# Altium schematic sheet Isolators.SchDoc: Optocouplers
size A3; Author: M.Beldyga; CompanyName: WUT ISE; DrawnBy: M.Beldyga; Organization: WUT ISE; Address1: PW ISE; Address2: Nowowiejska 15/19 00-665 Warsaw; Address3: micbeldyga@gmail.com; SheetNumber: 6; SheetTotal: 7; ModifiedBy: -; CheckedDate: -; DivGrp: WUT ISE; Designer: M.Beldyga; ModifiedDate: -; ProjectName: Sensor Box
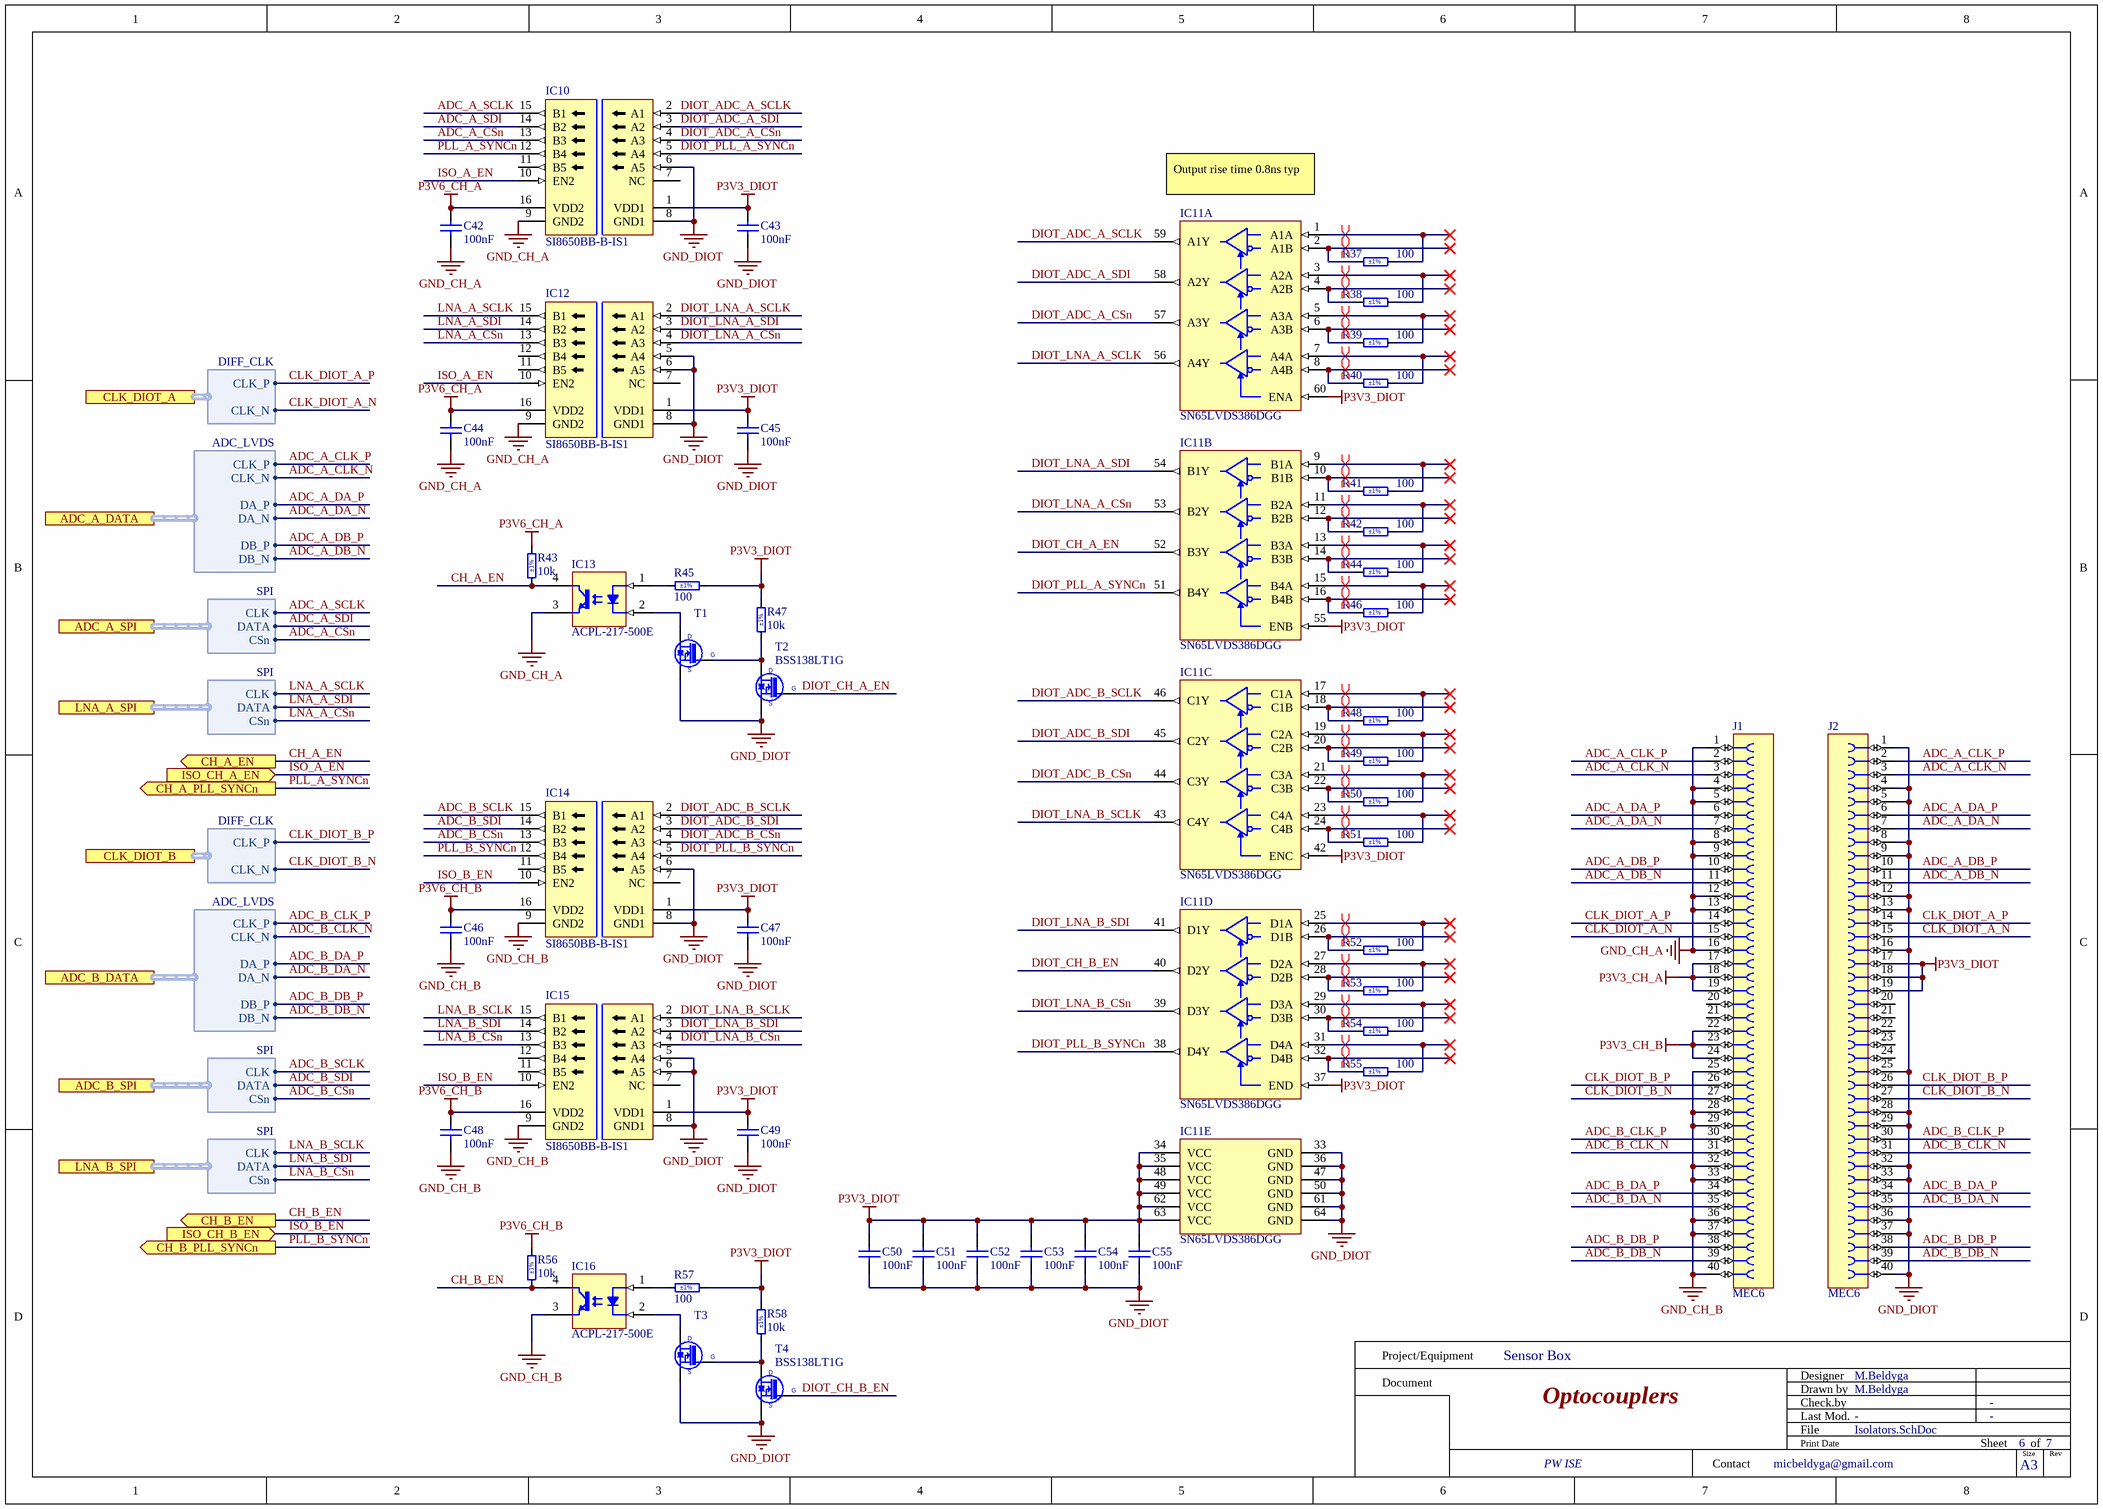
[diagram p0: Isolators.SchDoc]

## Parts
C42  100nF  [CAPC1005X55N]
C43  100nF  [CAPC1005X55N]
C44  100nF  [CAPC1005X55N]
C45  100nF  [CAPC1005X55N]
C46  100nF  [CAPC1005X55N]
C47  100nF  [CAPC1005X55N]
C48  100nF  [CAPC1005X55N]
C49  100nF  [CAPC1005X55N]
C50  100nF  [CAPC1005X55N]
C51  100nF  [CAPC1005X55N]
C52  100nF  [CAPC1005X55N]
C53  100nF  [CAPC1005X55N]
C54  100nF  [CAPC1005X55N]
C55  100nF  [CAPC1005X55N]
IC10  SI8650BB-B-IS1  [SOIC127P600X175-16N]
IC11  SN65LVDS386DGG  [SOP50P810X120-64N]  (parts A,B,C,D,E of 5)
IC12  SI8650BB-B-IS1  [SOIC127P600X175-16N]
IC13  ACPL-217-500E  [SOIC127P700X242-4N]
IC14  SI8650BB-B-IS1  [SOIC127P600X175-16N]
IC15  SI8650BB-B-IS1  [SOIC127P600X175-16N]
IC16  ACPL-217-500E  [SOIC127P700X242-4N]
J1  MEC6  [SAMTEC_MEC6-120-02-L-DV-A]
J2  MEC6  [SAMTEC_MEC6-120-02-L-DV-A]
R37  100  Tolerance: ±1%  [RESC1005X40N]
R38  100  Tolerance: ±1%  [RESC1005X40N]
R39  100  Tolerance: ±1%  [RESC1005X40N]
R40  100  Tolerance: ±1%  [RESC1005X40N]
R41  100  Tolerance: ±1%  [RESC1005X40N]
R42  100  Tolerance: ±1%  [RESC1005X40N]
R43  10k  Tolerance: ±1%  [RESC1005X40N]
R44  100  Tolerance: ±1%  [RESC1005X40N]
R45  100  Tolerance: ±1%  [RESC1005X40N]
R46  100  Tolerance: ±1%  [RESC1005X40N]
R47  10k  Tolerance: ±1%  [RESC1005X40N]
R48  100  Tolerance: ±1%  [RESC1005X40N]
R49  100  Tolerance: ±1%  [RESC1005X40N]
R50  100  Tolerance: ±1%  [RESC1005X40N]
R51  100  Tolerance: ±1%  [RESC1005X40N]
R52  100  Tolerance: ±1%  [RESC1005X40N]
R53  100  Tolerance: ±1%  [RESC1005X40N]
R54  100  Tolerance: ±1%  [RESC1005X40N]
R55  100  Tolerance: ±1%  [RESC1005X40N]
R56  10k  Tolerance: ±1%  [RESC1005X40N]
R57  100  Tolerance: ±1%  [RESC1005X40N]
R58  10k  Tolerance: ±1%  [RESC1005X40N]
T1  BSS138LT1G  [SOT95P240X110-3N]  (value not drawn)
T2  BSS138LT1G  [SOT95P240X110-3N]
T3  BSS138LT1G  [SOT95P240X110-3N]  (value not drawn)
T4  BSS138LT1G  [SOT95P240X110-3N]

## Ports
ADC_A_DATA (harness ADC_LVDS), ADC_A_SPI (harness SPI), ADC_B_DATA (harness ADC_LVDS), ADC_B_SPI (harness SPI), CH_A_EN (out), CH_A_PLL_SYNCn (out), CH_B_EN (out), CH_B_PLL_SYNCn (out), CLK_DIOT_A (harness DIFF_CLK), CLK_DIOT_B (harness DIFF_CLK), ISO_CH_A_EN (in), ISO_CH_B_EN (in), LNA_A_SPI (harness SPI), LNA_B_SPI (harness SPI)

## Harnesses
ADC_LVDS: CLK_P, CLK_N, DA_P, DA_N, DB_P, DB_N
SPI: CLK, DATA, CSn
DIFF_CLK: CLK_P, CLK_N

## Nets
GND_CH_A: C42.1 C44.1 IC10.9(GND2) IC12.9(GND2) IC13.3(E) J1.1 J1.4 J1.5 J1.8 J1.9 J1.12 J1.13 J1.16
GND_CH_B: C46.1 C48.1 IC14.9(GND2) IC15.9(GND2) IC16.3(E) J1.25 J1.28 J1.29 J1.32 J1.33 J1.36 J1.37 J1.40
GND_DIOT: C43.1 C45.1 C47.1 C49.1 C50.1 C51.1 C52.1 C53.1 C54.1 C55.1 IC10.6(A5) IC10.8(GND1) IC11.33(GND) IC11.36(GND) IC11.47(GND) IC11.50(GND) IC11.61(GND) IC11.64(GND) IC12.5(A4) IC12.6(A5) IC12.8(GND1) IC14.6(A5) IC14.8(GND1) IC15.5(A4) IC15.6(A5) IC15.8(GND1) J2.1 J2.4 J2.5 J2.8 J2.9 J2.12 J2.13 J2.16 J2.25 J2.28 J2.29 J2.32 J2.33 J2.36 J2.37 J2.40 T1.2(S) T2.2(S) T3.2(S) T4.2(S)
P3V3_CH_A: J1.17 J1.18 J1.19
P3V3_CH_B: J1.22 J1.23 J1.24
P3V3_DIOT: C43.2 C45.2 C47.2 C49.2 C50.2 C51.2 C52.2 C53.2 C54.2 C55.2 IC10.1(VDD1) IC11.34(VCC) IC11.35(VCC) IC11.37(END) IC11.42(ENC) IC11.48(VCC) IC11.49(VCC) IC11.55(ENB) IC11.60(ENA) IC11.62(VCC) IC11.63(VCC) IC12.1(VDD1) IC14.1(VDD1) IC15.1(VDD1) J2.17 J2.18 J2.19 R45.1 R47.2 R57.1 R58.2
P3V6_CH_A: C42.2 C44.2 IC10.16(VDD2) IC12.16(VDD2) R43.2
P3V6_CH_B: C46.2 C48.2 IC14.16(VDD2) IC15.16(VDD2) R56.2
ADC_A_CLK_N: J1.3 J2.3 ; port ADC_A_DATA.CLK_N
ADC_A_CLK_P: J1.2 J2.2 ; port ADC_A_DATA.CLK_P
ADC_A_CSn: IC10.13(B3) ; port ADC_A_SPI.CSn
ADC_A_DA_N: J1.7 J2.7 ; port ADC_A_DATA.DA_N
ADC_A_DA_P: J1.6 J2.6 ; port ADC_A_DATA.DA_P
ADC_A_DB_N: J1.11 J2.11 ; port ADC_A_DATA.DB_N
ADC_A_DB_P: J1.10 J2.10 ; port ADC_A_DATA.DB_P
ADC_A_SCLK: IC10.15(B1) ; port ADC_A_SPI.CLK
ADC_A_SDI: IC10.14(B2) ; port ADC_A_SPI.DATA
ADC_B_CLK_N: J1.31 J2.31 ; port ADC_B_DATA.CLK_N
ADC_B_CLK_P: J1.30 J2.30 ; port ADC_B_DATA.CLK_P
ADC_B_CSn: IC14.13(B3) ; port ADC_B_SPI.CSn
ADC_B_DA_N: J1.35 J2.35 ; port ADC_B_DATA.DA_N
ADC_B_DA_P: J1.34 J2.34 ; port ADC_B_DATA.DA_P
ADC_B_DB_N: J1.39 J2.39 ; port ADC_B_DATA.DB_N
ADC_B_DB_P: J1.38 J2.38 ; port ADC_B_DATA.DB_P
ADC_B_SCLK: IC14.15(B1) ; port ADC_B_SPI.CLK
ADC_B_SDI: IC14.14(B2) ; port ADC_B_SPI.DATA
CH_A_EN: IC13.4(C) R43.1 ; port CH_A_EN
CH_B_EN: IC16.4(C) R56.1 ; port CH_B_EN
CLK_DIOT_A_N: J1.15 J2.15 ; port CLK_DIOT_A.CLK_N
CLK_DIOT_A_P: J1.14 J2.14 ; port CLK_DIOT_A.CLK_P
CLK_DIOT_B_N: J1.27 J2.27 ; port CLK_DIOT_B.CLK_N
CLK_DIOT_B_P: J1.26 J2.26 ; port CLK_DIOT_B.CLK_P
DIOT_ADC_A_CSn: IC10.4(A3) IC11.57(A3Y)
DIOT_ADC_A_SCLK: IC10.2(A1) IC11.59(A1Y)
DIOT_ADC_A_SDI: IC10.3(A2) IC11.58(A2Y)
DIOT_ADC_B_CSn: IC11.44(C3Y) IC14.4(A3)
DIOT_ADC_B_SCLK: IC11.46(C1Y) IC14.2(A1)
DIOT_ADC_B_SDI: IC11.45(C2Y) IC14.3(A2)
DIOT_CH_A_EN: IC11.52(B3Y) T2.1(G)
DIOT_CH_B_EN: IC11.40(D2Y) T4.1(G)
DIOT_LNA_A_CSn: IC11.53(B2Y) IC12.4(A3)
DIOT_LNA_A_SCLK: IC11.56(A4Y) IC12.2(A1)
DIOT_LNA_A_SDI: IC11.54(B1Y) IC12.3(A2)
DIOT_LNA_B_CSn: IC11.39(D3Y) IC15.4(A3)
DIOT_LNA_B_SCLK: IC11.43(C4Y) IC15.2(A1)
DIOT_LNA_B_SDI: IC11.41(D1Y) IC15.3(A2)
DIOT_PLL_A_SYNCn: IC10.5(A4) IC11.51(B4Y)
DIOT_PLL_B_SYNCn: IC11.38(D4Y) IC14.5(A4)
ISO_A_EN: IC10.10(EN2) IC12.10(EN2) ; port ISO_CH_A_EN
ISO_B_EN: IC14.10(EN2) IC15.10(EN2) ; port ISO_CH_B_EN
LNA_A_CSn: IC12.13(B3) ; port LNA_A_SPI.CSn
LNA_A_SCLK: IC12.15(B1) ; port LNA_A_SPI.CLK
LNA_A_SDI: IC12.14(B2) ; port LNA_A_SPI.DATA
LNA_B_CSn: IC15.13(B3) ; port LNA_B_SPI.CSn
LNA_B_SCLK: IC15.15(B1) ; port LNA_B_SPI.CLK
LNA_B_SDI: IC15.14(B2) ; port LNA_B_SPI.DATA
PLL_A_SYNCn: IC10.12(B4) ; port CH_A_PLL_SYNCn
PLL_B_SYNCn: IC14.12(B4) ; port CH_B_PLL_SYNCn
NetIC11_1: IC11.1(A1A) R37.2
NetIC11_2: IC11.2(A1B) R37.1
NetIC11_3: IC11.3(A2A) R38.2
NetIC11_4: IC11.4(A2B) R38.1
NetIC11_5: IC11.5(A3A) R39.2
NetIC11_6: IC11.6(A3B) R39.1
NetIC11_7: IC11.7(A4A) R40.2
NetIC11_8: IC11.8(A4B) R40.1
NetIC11_9: IC11.9(B1A) R41.2
NetIC11_10: IC11.10(B1B) R41.1
NetIC11_11: IC11.11(B2A) R42.2
NetIC11_12: IC11.12(B2B) R42.1
NetIC11_13: IC11.13(B3A) R44.2
NetIC11_14: IC11.14(B3B) R44.1
NetIC11_15: IC11.15(B4A) R46.2
NetIC11_16: IC11.16(B4B) R46.1
NetIC11_17: IC11.17(C1A) R48.2
NetIC11_18: IC11.18(C1B) R48.1
NetIC11_19: IC11.19(C2A) R49.2
NetIC11_20: IC11.20(C2B) R49.1
NetIC11_21: IC11.21(C3A) R50.2
NetIC11_22: IC11.22(C3B) R50.1
NetIC11_23: IC11.23(C4A) R51.2
NetIC11_24: IC11.24(C4B) R51.1
NetIC11_25: IC11.25(D1A) R52.2
NetIC11_26: IC11.26(D1B) R52.1
NetIC11_27: IC11.27(D2A) R53.2
NetIC11_28: IC11.28(D2B) R53.1
NetIC11_29: IC11.29(D3A) R54.2
NetIC11_30: IC11.30(D3B) R54.1
NetIC11_31: IC11.31(D4A) R55.2
NetIC11_32: IC11.32(D4B) R55.1
NetIC13_1: IC13.1(A) R45.2
NetIC13_2: IC13.2(C) T1.3(D)
NetIC16_1: IC16.1(A) R57.2
NetIC16_2: IC16.2(C) T3.3(D)
NetR47_1: R47.1 T1.1(G) T2.3(D)
NetR58_1: R58.1 T3.1(G) T4.3(D)

Not connected (* = marked no-connect by the designer): IC10 7(NC) 11(B5); IC12 7(NC) 11(B5) 12(B4); IC14 7(NC) 11(B5); IC15 7(NC) 11(B5) 12(B4); J1 20 21; J2 20 21 22 23 24

## Layout directives
differential pair; net class D100: NetIC11_1, NetIC11_2, NetIC11_3, NetIC11_4, NetIC11_5, NetIC11_6, NetIC11_7, NetIC11_8, NetIC11_9, NetIC11_10, NetIC11_11, NetIC11_12, NetIC11_13, NetIC11_14, NetIC11_15, NetIC11_16, NetIC11_17, NetIC11_18, NetIC11_19, NetIC11_20, NetIC11_21, NetIC11_22, NetIC11_23, NetIC11_24, NetIC11_25, NetIC11_26, NetIC11_27, NetIC11_28, NetIC11_29, NetIC11_30, NetIC11_31, NetIC11_32

## Notes on the sheet
- (near IC11) Output rise time 0.8ns typ
- Project/Equipment
- Document
- Designer
- Drawn by
- Check.by
- Contact
- File
- Last Mod.
- Print Date
- Sheet
- Size
- A3
- of
- Rev

## Library data of the parts
C42-C55 = CC0402_100NF_50V_10%_X7R: Non-polarised capacitor; Part Description: SMD Multilayer Chip Ceramic Capacitor; Manufacturer: GENERIC; Manufacturer1 Part Number: GRM155R71H104KE14D; Voltage: 50V; TC: X7R; Tolerance: ±10%; Part Number: CC0402_100NF_50V_10%_X7R; Component Kind: Standard; Component Type: Standard; Pin Count: 2; Value: 100nF; Status: None; Manufacturer Part Number: CC0402_100NF_50V_10%_X7R; Case: 0402; Mounted: Yes; Socket: No; SMD: Yes; Sense: No; Manufacturer1 Example: MURATA; Manufacturer1 ComponentHeight: 0.55mm; HelpURL: \\cern.ch\dfs\Applications\Altium\Datasheets\CC0402_MURATA_GRM155R71H104KE14D.pdf; Author: CERN DEM MR; CreateDate: 6/30/2017; LatestRevisionDate: 6/30/2017
IC10 IC12 IC14 IC15 = SI8650BB-B-IS1: Low Power Five-Channel Digital Isolator; Part Description: 2.5kV 150Mbps Low Power Five-Channel Digital Isolator; Manufacturer: SKYWORKS; Manufacturer Part Number: SI8651BB-B-IS1; PressFit: No; Bonding: No; Part Number: SI8650BB-B-IS1; Component Kind: Standard; Component Type: Standard; Device: SI8650BB-B-IS1; PackageDescription: SOIC, 1.27mm Pitch; 16 pin, 3.90mm W X 9.90mm L X 1.75mm H body, IPC Medium Density; Pin Count: 16; Case: SOIC16; Mounted: Yes; Socket: No; SMD: Yes; Sense: No; ComponentHeight: 1.75mm; Author: CERN DEM HF; HelpURL: \\cern.ch\dfs\Applications\Altium\Datasheets\SI8650BB-B-IS1.pdf; CreateDate: 10/14/2021; LatestRevisionDate: 10/14/2021
IC11 = SN65LVDS386DGG: 16 High-Speed Differential Line Receiver; Manufacturer: TEXAS INSTRUMENTS; PressFit: No; Bonding: No; Part Number: SN65LVDS386DGG; Component Kind: Standard; Component Type: Standard; Device: SN65LVDS386DGG; PackageDescription: SOP, 0.50mm Pitch; 64 Pin, 6.10mm W X 17.0mm L X 1.20mm H body, IPC Medium Density; Part Description: 16 High-Speed Differential Line Receiver; Manufacturer Part Number: SN65LVDS386DGG; Pin Count: 64; Case: TSSOP64; Mounted: Yes; Socket: No; SMD: Yes; Sense: No; ComponentHeight: 1.2mm; Author: CERN DEM BC; HelpURL: \\cern.ch\dfs\Applications\Altium\Datasheets\SN65LVDS386.pdf; CreateDate: 8/26/2015; LatestRevisionDate: 8/26/2015
IC13 IC16 = ACPL-217-500E: Single Optocoupler; Part Description: DC Input, Half-Pitch Phototransistor Optocoupler; Manufacturer: AVAGO TECHNOLOGIES; PressFit: No; Bonding: No; Part Number: ACPL-217-500E; Component Kind: Standard; Component Type: Standard; Device: ACPL-217-500E; PackageDescription: SOIC, 1.27mm Pitch; 4 Pin, 2.60mm W X 4.40mm L X 2.42mm H body, IPC Medium Density; Status: Not Recommended; Manufacturer Part Number: ACPL-217-500E; Pin Count: 4; Case: SOIC4; Mounted: Yes; Socket: No; SMD: Yes; Sense: No; ComponentHeight: 2.42mm; HelpURL: \\cern.ch\dfs\Applications\Altium\Datasheets\ACPL-217-500E.pdf; Author: CERN DEM JLC; CreateDate: 11/11/2014; LatestRevisionDate: 11/11/2014
J1 J2 = MEC6-120-02-L-DV-A: Connector 40 Female; Part Description: 40 Contacts, Pitch 0.635mm, Double Row Vertical Micro Edge Card Socket; Manufacturer: SAMTEC; PressFit: No; Part Number: MEC6-120-02-L-DV-A; Component Kind: Standard; Component Type: Standard; Pin Count: 40; Family: MEC6; SMD: Yes; Status: Active; Manufacturer Part Number: MEC6-120-02-L-DV-A; ComponentHeight: 8.65mm; Author: Michal Beldyga; CreateDate: 2/9/2025; LatestRevisionDate: 2/9/2025
R37-R42 R44-R46 R48-R55 R57 = R0402_100R_1%_0.0625W_100PPM: Resistor - 1%; Part Description: General Purpose Thick Film Chip Resistor; Manufacturer: GENERIC; Manufacturer1 Part Number: 232270671001L; TC: ±100ppm/°C; PressFit: No; Part Number: R0402_100R_1%_0.0625W_100PPM; Component Kind: Standard; Component Type: Standard; Pin Count: 2; Value: 100; Status: Not Recommended; Power: 0.0625W; Manufacturer Part Number: R0402_100R_1%_0.0625W_100PPM; Case: 0402; Mounted: Yes; Sense: No; Socket: No; SMD: Yes; Manufacturer1 Example: YAGEO PHYCOMP; Manufacturer1 ComponentHeight: 0.4mm; HelpURL: \\cern.ch\dfs\Applications\Altium\Datasheets\R0402_Phycomp_RC0402.pdf; Author: CERN DEM JLC; CreateDate: 12/3/2007; LatestRevisionDate: 10/17/2012
R43 R47 R56 R58 = R0402_10K_1%_0.0625W_100PPM: Resistor - 1%; Part Description: General Purpose Thick Film Chip Resistor; Manufacturer: GENERIC; Manufacturer1 Part Number: 232270671003L; TC: ±100ppm/°C; PressFit: No; Part Number: R0402_10K_1%_0.0625W_100PPM; Component Kind: Standard; Component Type: Standard; Pin Count: 2; Value: 10k; Status: Not Recommended; Power: 0.0625W; Manufacturer Part Number: R0402_10K_1%_0.0625W_100PPM; Case: 0402; Mounted: Yes; Sense: No; Socket: No; SMD: Yes; Manufacturer1 Example: YAGEO PHYCOMP; Manufacturer1 ComponentHeight: 0.4mm; HelpURL: \\cern.ch\dfs\Applications\Altium\Datasheets\R0402_Phycomp_RC0402.pdf; Author: CERN DEM JLC; CreateDate: 12/3/2007; LatestRevisionDate: 10/17/2012
T1-T4 = BSS138LT1G: N-CHANNEL MOSFET WITH DIODE; Part Description: 50V 200mA N-Channel Enhancement Mode Field-Effect Transistor; Manufacturer: ON SEMICONDUCTOR; PressFit: No; Bonding: No; Part Number: BSS138LT1G; Component Kind: Standard; Component Type: Standard; Device: BSS138LT1G; PackageDescription: SOT23 3-Leads, Pitch 0.95mm - Body 1.4x3mm, IPC Medium Density; Manufacturer Part Number: BSS138LT1G; Pin Count: 3; Case: SOT23-3; Mounted: Yes; Socket: No; SMD: Yes; Sense: No; ComponentHeight: 1.11mm; HelpURL: \\cern.ch\dfs\Applications\Altium\Datasheets\BSS138LT1G.pdf; Author: CERN DEM JLC; CreateDate: 23.03.2009; LatestRevisionDate: 23.03.2009